# Altium schematic sheet Power_Supply.SchDoc
size A4; Organization: Altium Limited; Address1: L3, 12a Rodborough Rd; Address2: Frenchs Forest; Address3: NSW; Address4: Australia 2086
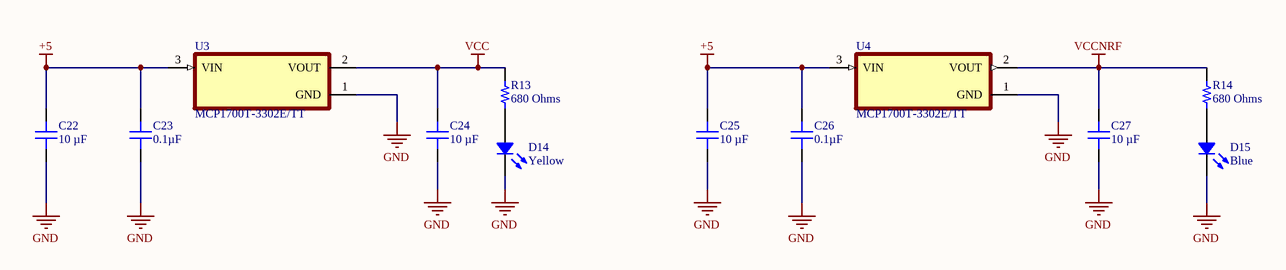
[diagram p0: Power_Supply.SchDoc]

## Parts
C22  10 µF  [CAP 0603_1608]
C23  0.1µF  [CAP 0603_1608]
C24  10 µF  [CAP 0603_1608]
C25  10 µF  [CAP 0603_1608]
C26  0.1µF  [CAP 0603_1608]
C27  10 µF  [CAP 0603_1608]
D14  Yellow  [LED 0603_1608 YELLOW]
D15  Blue  [LED 0603_1608 BLUE]
R13  680 Ohms  [RES 0603_1608]
R14  680 Ohms  [RES 0603_1608]
U3  MCP1700T-3302E/TT  [SOT95P237X112-3N]
U4  MCP1700T-3302E/TT  [SOT95P237X112-3N]

## Nets
+5: C22.2 C23.2 C25.2 C26.2 U3.3(VIN) U4.3(VIN)
GND: C22.1 C23.1 C24.1 C25.1 C26.1 C27.1 D14.2 D15.2 U3.1(GND) U4.1(GND)
VCC: C24.2 R13.2 U3.2(VOUT)
VCCNRF: C27.2 R14.2 U4.2(VOUT)
NetD14_1: D14.1 R13.1
NetD15_1: D15.1 R14.1

## Notes on the sheet
- Title
- Size:
- Date:
- A4
- Number:
- Time:
- Revision:
- Sheet
- of
- File:

## Library data of the parts
C22 C24 C25 C27 = KGM15CS60J106MT: CAP CER 10UF 6.3V X6S 0603; manufacturer: KYOCERA AVX; Tolerance: ±20%; Part Number: KGM15CS60J106MT; Value: 10 µF; Applications: General Purpose; Capacitance: 10 µF; componentlink1description: Datasheet; componentlink1url: https://datasheets.kyocera-avx.com/x6s-dielectric.pdf; componentlink2description: DigiKey Link; componentlink2url: https://www.digikey.com/en/products/detail/kyocera-avx/KGM15CS60J106MT/17866394; Device Package: 0603 (1608 Metric); lastupdated: 2/9/2024 8:09:11 PM; Lifecycle Status: Active; Minimum Order: 1; Mounting Type: Surface Mount, MLCC; Operating Temperature: -55°C ~ 105°C; Package / Case: 0603 (1608 Metric); packaging: TapeAndReel; partid: 53178; Part Status: Active; price: 0.03; series: KGM - X6S; Size / Dimension: 0.063" L x 0.031" W (1.60mm x 0.80mm); Supplier 1: DigiKey; Supplier Part Number 1: 478-KGM15CS60J106MTCT-ND; Temperature Coefficient: X6S; Thickness (Max): 0.039" (1.00mm); Voltage - Rated: 6.3V
C23 C26 = 0603YC104K4T4A: CAP CER 0.1UF 16V X7R 0603; manufacturer: AVX Corporation; Tolerance: ±10%; Part Number: 0603YC104K4T4A; Value: 0.1µF; Applications: Automotive; Capacitance: 0.1µF; componentlink1description: Datasheet; componentlink1url: http://datasheets.avx.com/AutoMLCC.pdf; componentlink2description: DigiKey Link; componentlink2url: http://digikey.com/product-detail/en/avx-corporation/0603YC104K4T4A/478-9382-1-ND/4901449; Device Package: 0603 (1608 Metric); lastupdated: 9/2/2020 1:03:04 AM; Lifecycle Status: Active; Minimum Order: 1; Mounting Type: Surface Mount, MLCC; Operating Temperature: -55°C ~ 125°C; Package / Case: 0603 (1608 Metric); packaging: TapeAndReel; partid: 17140; Part Status: Active; price: 0.02; Ratings: AEC-Q200; series: -; Size / Dimension: 0.063" L x 0.032" W (1.60mm x 0.81mm); Supplier 1: DigiKey; Supplier Part Number 1: 478-9382-1-ND; Temperature Coefficient: X7R; Thickness (Max): 0.035" (0.90mm); Voltage - Rated: 16V
D14 = SML-D15YWT86: LED YELLOW DIFFUSED 1608 SMD; Manufacturer: Rohm Semiconductor; Configuration: Standard; Current - Test: 20mA; Lens Color: White; Lens Size: 1.20mm x 0.80mm; Lens Style: Rectangle with Flat Top; Millicandela Rating: 224mcd; Voltage - Forward (Vf) (Typ): 2.1V; Wavelength - Dominant: 590nm; Part Number: SML-D15YWT86; Color: Yellow; ComponentLink1Description: Datasheet; ComponentLink1URL: http://rohmfs.rohm.com/en/products/databook/datasheet/opto/led/chip_mono/sml-d15-e.pdf; ComponentLink2Description: DigiKey Link; ComponentLink2URL: https://www.digikey.com/en/products/detail/rohm-semiconductor/SML-D15YWT86/5822344; Device Package: 0603 (1608 Metric); Height (Max): 0.65mm; LastUpdated: 6/3/2024 8:01:10 PM; Lens Transparency: Diffused; Lifecycle Status: Active; Minimum Order: 1; Mounting Type: Surface Mount; Package / Case: 0603 (1608 Metric); Packaging: TapeAndReel; PartId: 114; Part Status: Active; Price: 0.06; Series: SML-D15; Size / Dimension: 1.60mm L x 0.80mm W; Supplier 1: DigiKey; Supplier Part Number 1: SML-D15YWT86DKR-ND; Supplier Device Package: 1608 (0603); Value: Yellow
D15 = LB Q39G-L2OO-35-1: LED BLUE DIFFUSED 0603 SMD; Manufacturer: OSRAM Opto Semiconductors Inc.; Configuration: Standard; Current - Test: 5mA; Lens Color: White; Lens Size: 1.10mm x 0.80mm; Lens Style: Rectangle with Flat Top; Millicandela Rating: 29.5mcd; Viewing Angle: 155°, 135°; Voltage - Forward (Vf) (Typ): 2.85V; Wavelength - Dominant: 470nm; Wavelength - Peak: 472nm; Part Number: LB Q39G-L2OO-35-1; Color: Blue; ComponentLink1Description: Datasheet; ComponentLink1URL: //media.digikey.com/pdf/Data%20Sheets/Osram%20PDFs/LB_Q39G_v1.4_9-1-15.pdf; ComponentLink2Description: DigiKey Link; ComponentLink2URL: https://www.digikey.com/en/products/detail/osram-opto-semiconductors-inc/LB-Q39G-L2OO-35-1/2176322; Device Package: 0603 (1608 Metric); Height (Max): 0.40mm; LastUpdated: 6/3/2024 7:57:52 PM; Lens Transparency: Diffused; Lifecycle Status: Active; Minimum Order: 1; Mounting Type: Surface Mount; Package / Case: 0603 (1608 Metric); Packaging: TapeAndReel; PartId: 832; Part Status: Active; Price: 0.06; Series: CHIPLED 0603; Size / Dimension: 1.60mm L x 0.80mm W; Supplier 1: DigiKey; Supplier Part Number 1: 475-2816-1-ND; Supplier Device Package: 0603; Value: Blue
R13 R14 = CRCW0603680RFKEA: RES SMD 680 OHM 1% 1/10W 0603; Manufacturer: Vishay Dale; Power (Watts): 0.1W, 1/10W; Temperature Coefficient: ±100ppm/°C; Part Number: CRCW0603680RFKEA; Value: 680 Ohms; ComponentLink1Description: Datasheet; ComponentLink1URL: http://www.vishay.com/docs/20035/dcrcwe3.pdf; ComponentLink2Description: DigiKey Link; ComponentLink2URL: https://www.digikey.com/en/products/detail/vishay-dale/CRCW0603680RFKEA/1174649; Composition: Thick Film; Device Package: 0603 (1608 Metric); Features: Automotive AEC-Q200; Height - Seated (Max): 0.020" (0.50mm); LastUpdated: 2/9/2024 8:43:05 PM; Lifecycle Status: Active; Minimum Order: 1; Number of Terminations: 2; Operating Temperature: -55°C ~ 155°C; Package / Case: 0603 (1608 Metric); Packaging: CutTape; PartId: 12674; Part Status: Active; Price: 0.01; Ratings: AEC-Q200; Resistance: 680 Ohms; Series: CRCW; Size / Dimension: 0.061" L x 0.033" W (1.55mm x 0.85mm); Supplier 1: DigiKey; Supplier Part Number 1: 541-680HCT-ND; Supplier Device Package: 0603; Tolerance: ±1%
U3 U4 = MCP1700T-3302E/TT: Linear Voltage Regulator IC 1 Output 250mA SOT-23-3; MF: Microchip; Availability: Unavailable; Value: *; Package: SOT-23-3 Microchip; Price: None; MP: MCP1700T-3302E/TT; SnapEDA_Link: https://www.snapeda.com/parts/MCP1700T-3302E/TT/Microchip/view-part/50877/?ref=snap